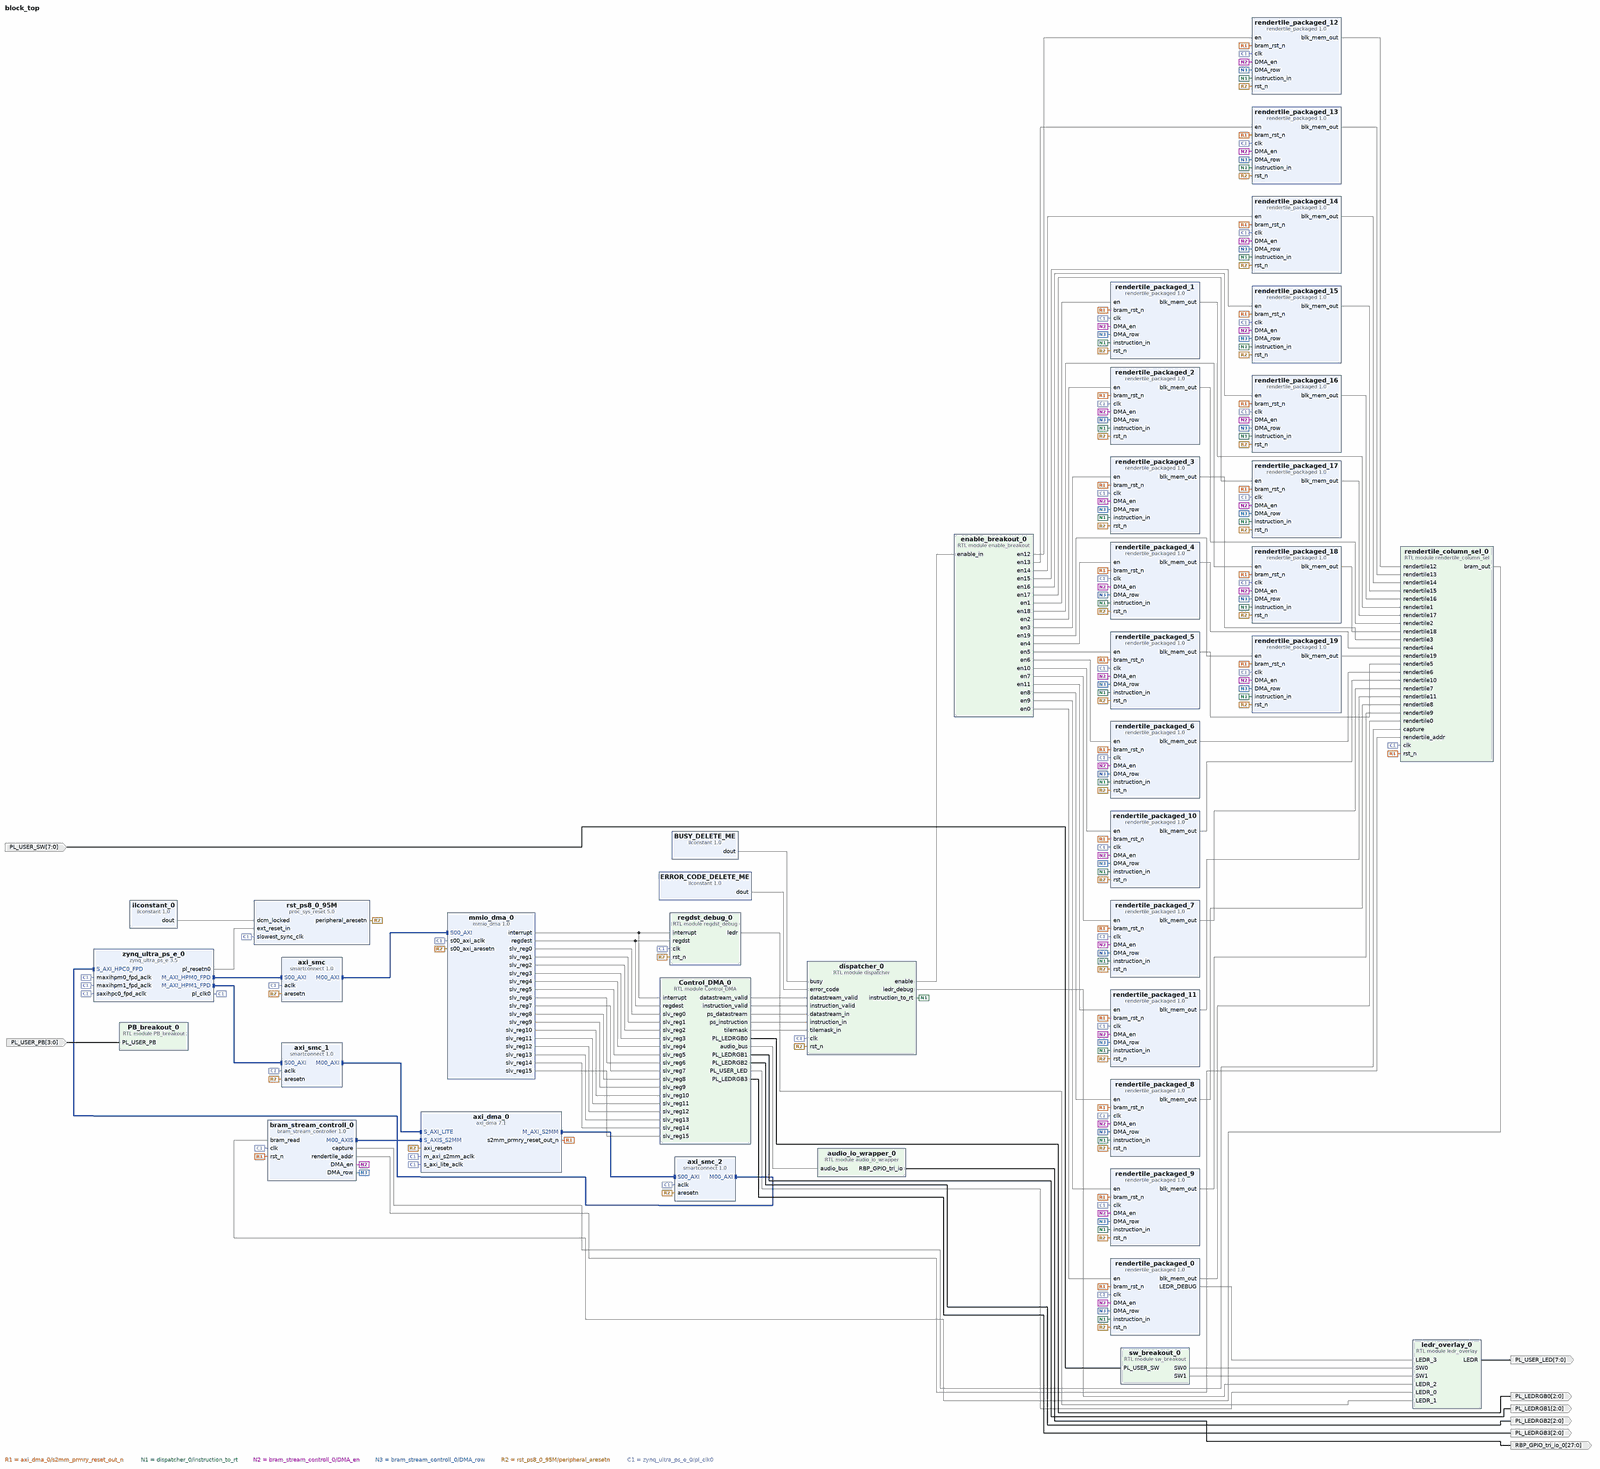
[diagram p0: block diagram of the top level, whole]
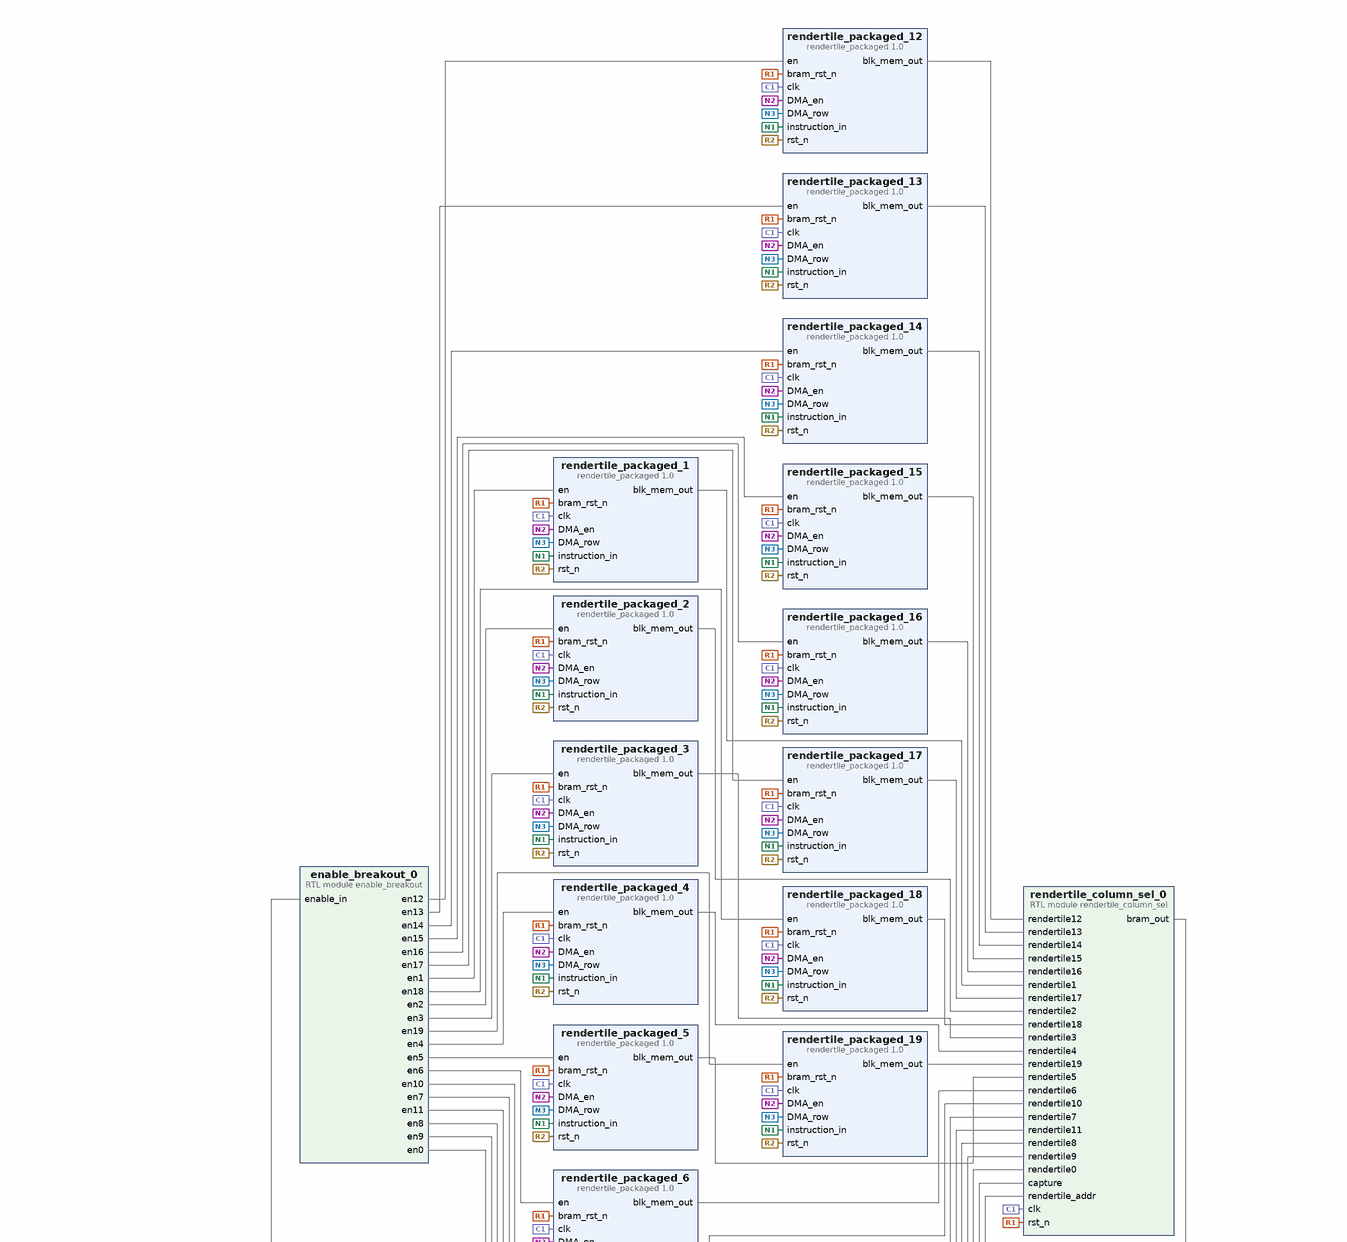
[diagram p1: block diagram of the top level, upper right part]
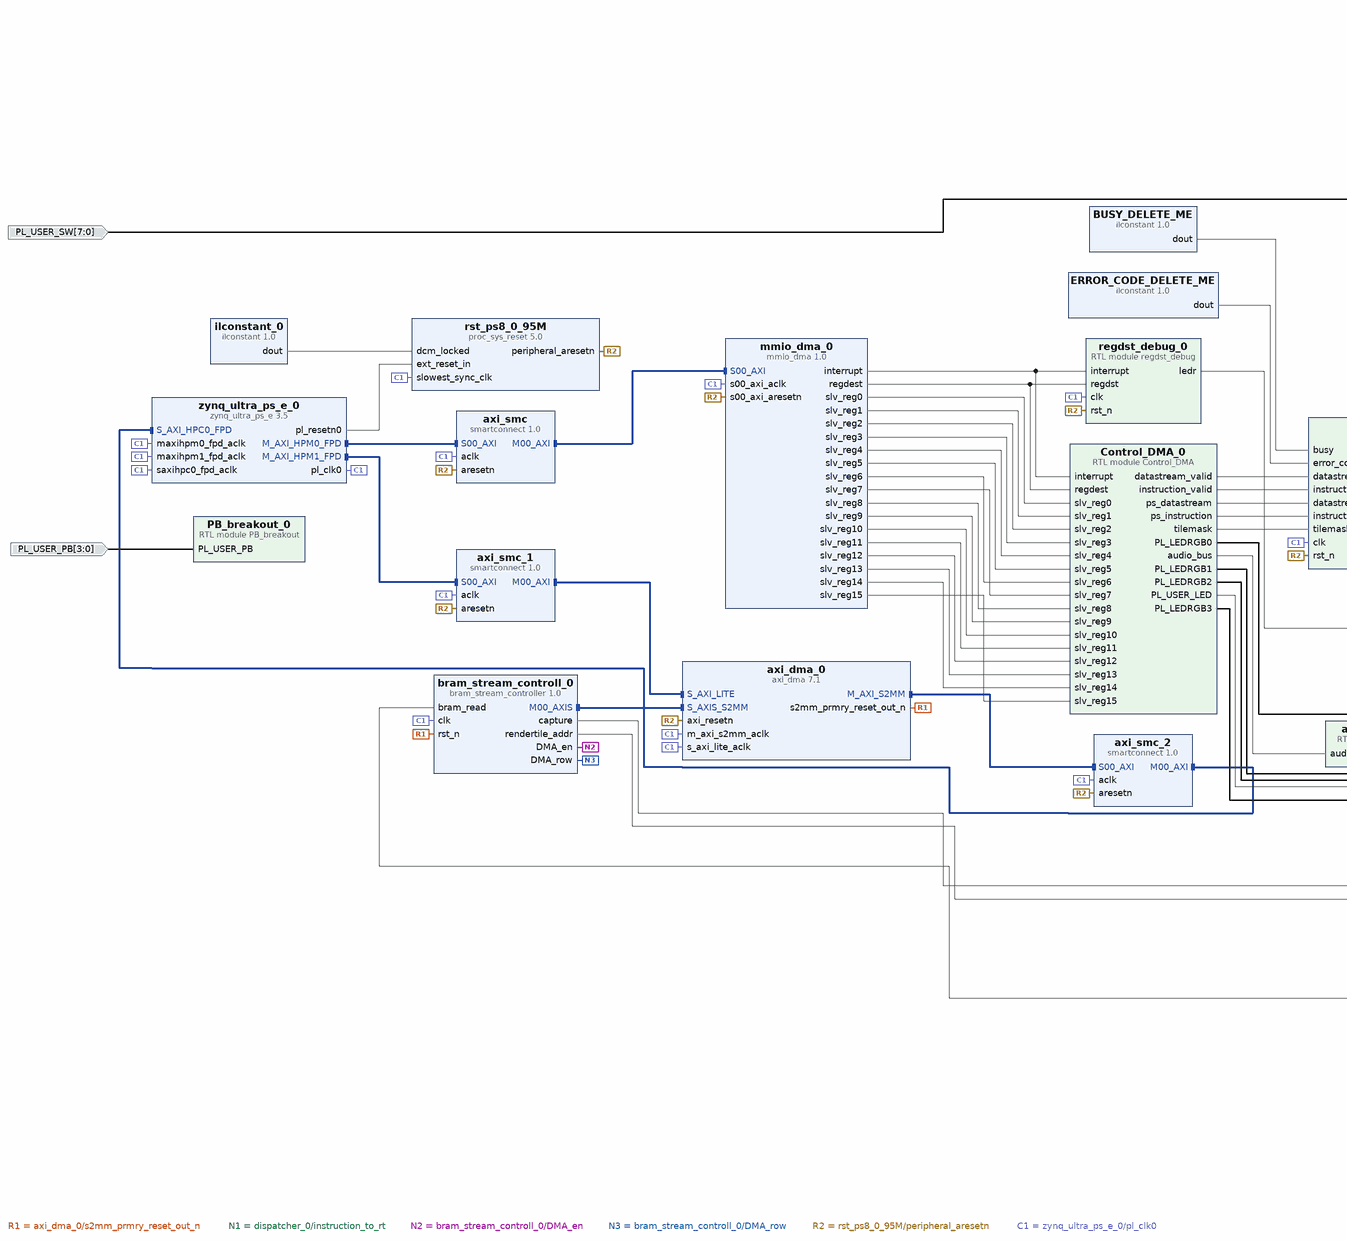
[diagram p2: block diagram of the top level, lower left part]
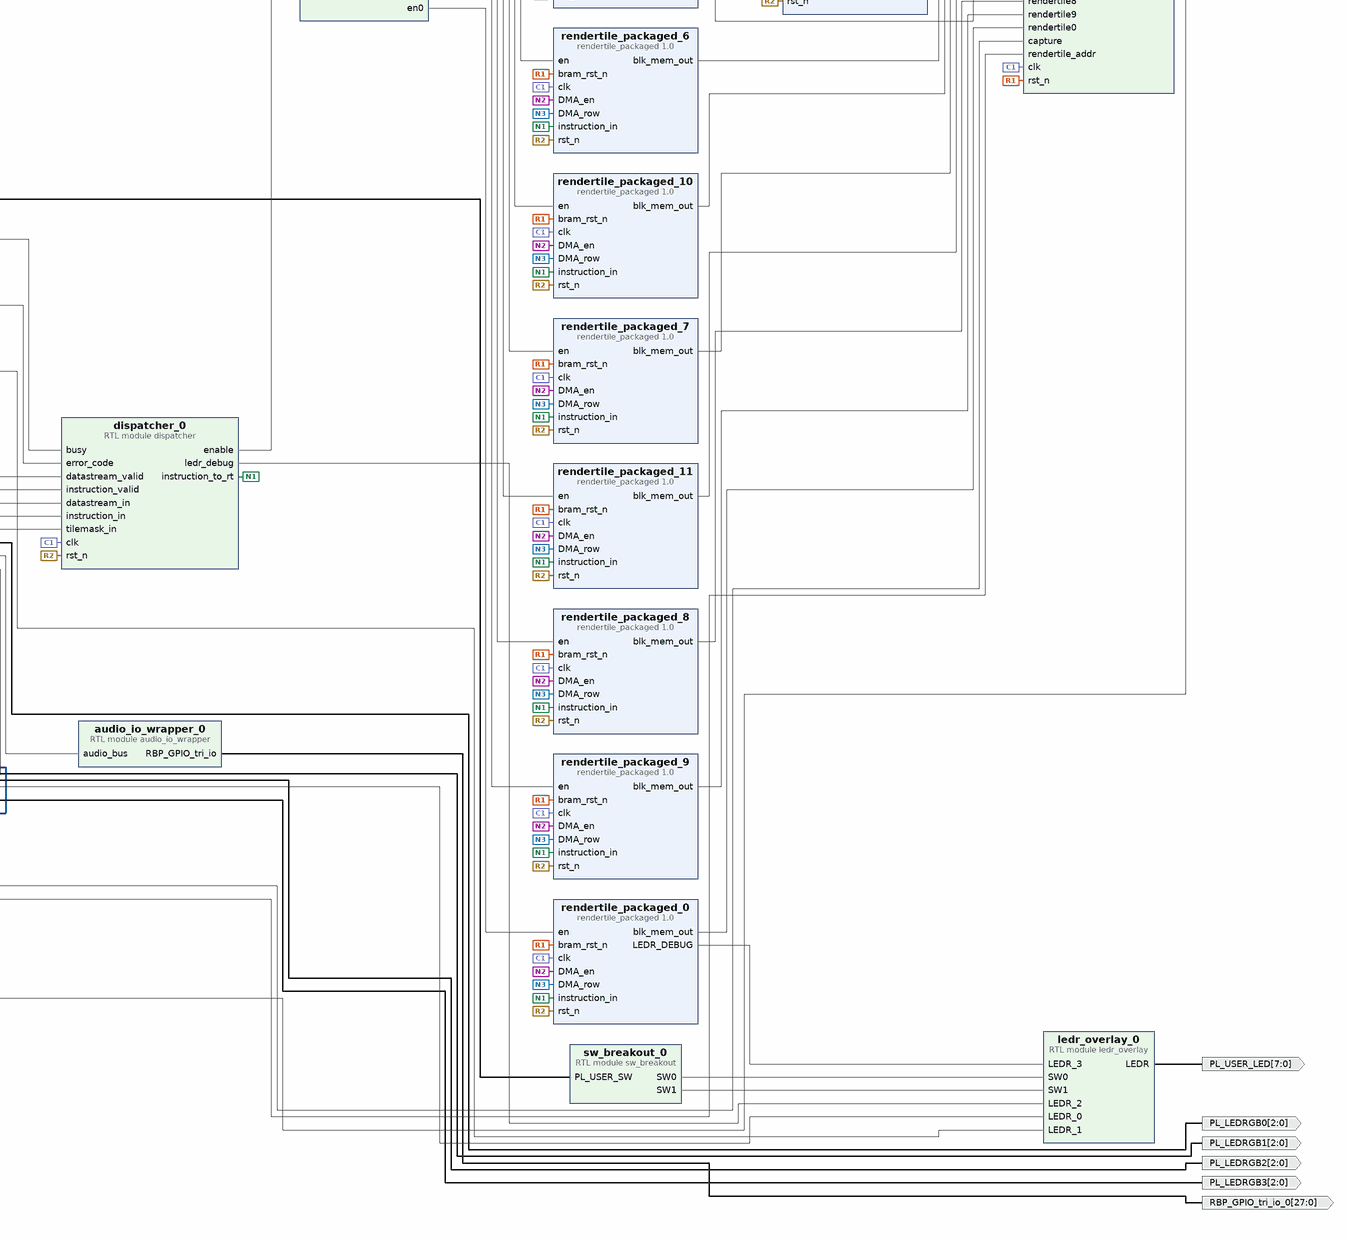
[diagram p3: block diagram of the top level, lower right part]
# Vivado block design block_top, xczu3eg-sfvc784-2-e, Vivado 2025.2
create_bd_design block_top

create_bd_port -dir O -from 7 -to 0 PL_USER_LED
create_bd_port -dir O -from 2 -to 0 PL_LEDRGB0
create_bd_port -dir O -from 2 -to 0 PL_LEDRGB1
create_bd_port -dir O -from 2 -to 0 PL_LEDRGB2
create_bd_port -dir O -from 2 -to 0 PL_LEDRGB3
create_bd_port -dir I -from 3 -to 0 PL_USER_PB
create_bd_port -dir I -from 7 -to 0 PL_USER_SW
create_bd_port -dir O -from 27 -to 0 RBP_GPIO_tri_io_0

create_bd_cell -type ip -vlnv xilinx.com:ip:zynq_ultra_ps_e:3.5 zynq_ultra_ps_e_0
set_property -dict [list \
  CONFIG.CAN0_BOARD_INTERFACE custom \
  CONFIG.CAN1_BOARD_INTERFACE custom \
  CONFIG.CSU_BOARD_INTERFACE custom \
  CONFIG.DP_BOARD_INTERFACE custom \
  CONFIG.GEM0_BOARD_INTERFACE custom \
  CONFIG.GEM1_BOARD_INTERFACE custom \
  CONFIG.GEM2_BOARD_INTERFACE custom \
  CONFIG.GEM3_BOARD_INTERFACE custom \
  CONFIG.GPIO_BOARD_INTERFACE custom \
  CONFIG.IIC0_BOARD_INTERFACE custom \
  CONFIG.IIC1_BOARD_INTERFACE custom \
  CONFIG.NAND_BOARD_INTERFACE custom \
  CONFIG.PCIE_BOARD_INTERFACE custom \
  CONFIG.PJTAG_BOARD_INTERFACE custom \
  CONFIG.PMU_BOARD_INTERFACE custom \
  CONFIG.PSU_BANK_0_IO_STANDARD LVCMOS33 \
  CONFIG.PSU_BANK_1_IO_STANDARD LVCMOS33 \
  CONFIG.PSU_BANK_2_IO_STANDARD LVCMOS33 \
  CONFIG.PSU_BANK_3_IO_STANDARD LVCMOS18 \
  CONFIG.PSU_USB3__DUAL_CLOCK_ENABLE 1 \
  CONFIG.PSU__CAN1__PERIPHERAL__ENABLE 0 \
  CONFIG.PSU__CRF_APB__ACPU_CTRL__FREQMHZ 1200 \
  CONFIG.PSU__CRF_APB__ACPU_CTRL__SRCSEL APLL \
  CONFIG.PSU__CRF_APB__APLL_CTRL__SRCSEL PSS_REF_CLK \
  CONFIG.PSU__CRF_APB__DBG_FPD_CTRL__FREQMHZ 250 \
  CONFIG.PSU__CRF_APB__DBG_FPD_CTRL__SRCSEL IOPLL \
  CONFIG.PSU__CRF_APB__DBG_TRACE_CTRL__FREQMHZ 250 \
  CONFIG.PSU__CRF_APB__DBG_TRACE_CTRL__SRCSEL IOPLL \
  CONFIG.PSU__CRF_APB__DBG_TSTMP_CTRL__FREQMHZ 250 \
  CONFIG.PSU__CRF_APB__DBG_TSTMP_CTRL__SRCSEL IOPLL \
  CONFIG.PSU__CRF_APB__DDR_CTRL__FREQMHZ 1200 \
  CONFIG.PSU__CRF_APB__DDR_CTRL__SRCSEL DPLL \
  CONFIG.PSU__CRF_APB__DPDMA_REF_CTRL__FREQMHZ 600 \
  CONFIG.PSU__CRF_APB__DPDMA_REF_CTRL__SRCSEL DPLL \
  CONFIG.PSU__CRF_APB__DPLL_CTRL__SRCSEL PSS_REF_CLK \
  CONFIG.PSU__CRF_APB__DP_AUDIO_REF_CTRL__SRCSEL RPLL \
  CONFIG.PSU__CRF_APB__DP_STC_REF_CTRL__SRCSEL RPLL \
  CONFIG.PSU__CRF_APB__DP_VIDEO_REF_CTRL__SRCSEL DPLL \
  CONFIG.PSU__CRF_APB__GDMA_REF_CTRL__FREQMHZ 600 \
  CONFIG.PSU__CRF_APB__GDMA_REF_CTRL__SRCSEL DPLL \
  CONFIG.PSU__CRF_APB__GPU_REF_CTRL__FREQMHZ 600 \
  CONFIG.PSU__CRF_APB__GPU_REF_CTRL__SRCSEL DPLL \
  CONFIG.PSU__CRF_APB__TOPSW_LSBUS_CTRL__FREQMHZ 100 \
  CONFIG.PSU__CRF_APB__TOPSW_LSBUS_CTRL__SRCSEL IOPLL \
  CONFIG.PSU__CRF_APB__TOPSW_MAIN_CTRL__FREQMHZ 533.333 \
  CONFIG.PSU__CRF_APB__TOPSW_MAIN_CTRL__SRCSEL DPLL \
  CONFIG.PSU__CRF_APB__VPLL_CTRL__SRCSEL PSS_REF_CLK \
  CONFIG.PSU__CRL_APB__ADMA_REF_CTRL__FREQMHZ 533.333 \
  CONFIG.PSU__CRL_APB__ADMA_REF_CTRL__SRCSEL RPLL \
  CONFIG.PSU__CRL_APB__CAN1_REF_CTRL__FREQMHZ 100 \
  CONFIG.PSU__CRL_APB__CAN1_REF_CTRL__SRCSEL IOPLL \
  CONFIG.PSU__CRL_APB__CPU_R5_CTRL__FREQMHZ 500 \
  CONFIG.PSU__CRL_APB__CPU_R5_CTRL__SRCSEL IOPLL \
  CONFIG.PSU__CRL_APB__DBG_LPD_CTRL__FREQMHZ 250 \
  CONFIG.PSU__CRL_APB__DBG_LPD_CTRL__SRCSEL IOPLL \
  CONFIG.PSU__CRL_APB__GEM3_REF_CTRL__FREQMHZ 125 \
  CONFIG.PSU__CRL_APB__GEM3_REF_CTRL__SRCSEL IOPLL \
  CONFIG.PSU__CRL_APB__I2C0_REF_CTRL__FREQMHZ 100 \
  CONFIG.PSU__CRL_APB__I2C0_REF_CTRL__SRCSEL IOPLL \
  CONFIG.PSU__CRL_APB__I2C1_REF_CTRL__FREQMHZ 100 \
  CONFIG.PSU__CRL_APB__I2C1_REF_CTRL__SRCSEL IOPLL \
  CONFIG.PSU__CRL_APB__IOPLL_CTRL__SRCSEL PSS_REF_CLK \
  CONFIG.PSU__CRL_APB__IOU_SWITCH_CTRL__FREQMHZ 267 \
  CONFIG.PSU__CRL_APB__IOU_SWITCH_CTRL__SRCSEL RPLL \
  CONFIG.PSU__CRL_APB__LPD_LSBUS_CTRL__FREQMHZ 100 \
  CONFIG.PSU__CRL_APB__LPD_LSBUS_CTRL__SRCSEL IOPLL \
  CONFIG.PSU__CRL_APB__LPD_SWITCH_CTRL__FREQMHZ 533.333 \
  CONFIG.PSU__CRL_APB__LPD_SWITCH_CTRL__SRCSEL RPLL \
  CONFIG.PSU__CRL_APB__PCAP_CTRL__FREQMHZ 200 \
  CONFIG.PSU__CRL_APB__PCAP_CTRL__SRCSEL IOPLL \
  CONFIG.PSU__CRL_APB__PL0_REF_CTRL__FREQMHZ 333 \
  CONFIG.PSU__CRL_APB__PL0_REF_CTRL__SRCSEL RPLL \
  CONFIG.PSU__CRL_APB__QSPI_REF_CTRL__FREQMHZ 300 \
  CONFIG.PSU__CRL_APB__QSPI_REF_CTRL__SRCSEL IOPLL \
  CONFIG.PSU__CRL_APB__RPLL_CTRL__SRCSEL PSS_REF_CLK \
  CONFIG.PSU__CRL_APB__SDIO0_REF_CTRL__SRCSEL IOPLL \
  CONFIG.PSU__CRL_APB__SDIO1_REF_CTRL__FREQMHZ 200 \
  CONFIG.PSU__CRL_APB__SDIO1_REF_CTRL__SRCSEL RPLL \
  CONFIG.PSU__CRL_APB__TIMESTAMP_REF_CTRL__FREQMHZ 100 \
  CONFIG.PSU__CRL_APB__TIMESTAMP_REF_CTRL__SRCSEL PSS_REF_CLK \
  CONFIG.PSU__CRL_APB__UART0_REF_CTRL__FREQMHZ 100 \
  CONFIG.PSU__CRL_APB__UART0_REF_CTRL__SRCSEL IOPLL \
  CONFIG.PSU__CRL_APB__UART1_REF_CTRL__FREQMHZ 100 \
  CONFIG.PSU__CRL_APB__UART1_REF_CTRL__SRCSEL IOPLL \
  CONFIG.PSU__CRL_APB__USB0_BUS_REF_CTRL__FREQMHZ 250 \
  CONFIG.PSU__CRL_APB__USB0_BUS_REF_CTRL__SRCSEL IOPLL \
  CONFIG.PSU__CRL_APB__USB3_DUAL_REF_CTRL__FREQMHZ 20 \
  CONFIG.PSU__CRL_APB__USB3_DUAL_REF_CTRL__SRCSEL IOPLL \
  CONFIG.PSU__CRL_APB__USB3__ENABLE 1 \
  CONFIG.PSU__CSUPMU__PERIPHERAL__VALID 0 \
  CONFIG.PSU__DDRC__BUS_WIDTH {32 Bit} \
  CONFIG.PSU__DDRC__COMPONENTS Components \
  CONFIG.PSU__DDRC__DEVICE_CAPACITY {16384 MBits} \
  CONFIG.PSU__DDRC__DRAM_WIDTH {8 Bits} \
  CONFIG.PSU__DDRC__ECC Disabled \
  CONFIG.PSU__DDRC__MEMORY_TYPE {DDR 4} \
  CONFIG.PSU__DDRC__SPEED_BIN DDR4_2400T \
  CONFIG.PSU__DDR_HIGH_ADDRESS_GUI_ENABLE 1 \
  CONFIG.PSU__DDR__INTERFACE__FREQMHZ 600.000 \
  CONFIG.PSU__DEVICE_TYPE EG \
  CONFIG.PSU__DISPLAYPORT__LANE0__ENABLE 1 \
  CONFIG.PSU__DISPLAYPORT__LANE0__IO {GT Lane1} \
  CONFIG.PSU__DISPLAYPORT__LANE1__ENABLE 1 \
  CONFIG.PSU__DISPLAYPORT__LANE1__IO {GT Lane0} \
  CONFIG.PSU__DISPLAYPORT__PERIPHERAL__ENABLE 1 \
  CONFIG.PSU__DLL__ISUSED 1 \
  CONFIG.PSU__DPAUX__PERIPHERAL__ENABLE 1 \
  CONFIG.PSU__DPAUX__PERIPHERAL__IO {MIO 27 .. 30} \
  CONFIG.PSU__DP__LANE_SEL {Dual Lower} \
  CONFIG.PSU__DP__REF_CLK_FREQ 27 \
  CONFIG.PSU__DP__REF_CLK_SEL {Ref Clk0} \
  CONFIG.PSU__ENET3__PERIPHERAL__ENABLE 0 \
  CONFIG.PSU__FPD_SLCR__WDT1__FREQMHZ 100 \
  CONFIG.PSU__FPGA_PL0_ENABLE 1 \
  CONFIG.PSU__GPIO0_MIO__IO {MIO 0 .. 25} \
  CONFIG.PSU__GPIO0_MIO__PERIPHERAL__ENABLE 1 \
  CONFIG.PSU__GPIO1_MIO__IO {MIO 26 .. 51} \
  CONFIG.PSU__GPIO1_MIO__PERIPHERAL__ENABLE 1 \
  CONFIG.PSU__GPIO2_MIO__IO {MIO 52 .. 77} \
  CONFIG.PSU__GPIO2_MIO__PERIPHERAL__ENABLE 1 \
  CONFIG.PSU__GPIO_EMIO_WIDTH 64 \
  CONFIG.PSU__GT__LINK_SPEED HBR \
  CONFIG.PSU__GT__PRE_EMPH_LVL_4 0 \
  CONFIG.PSU__GT__VLT_SWNG_LVL_4 0 \
  CONFIG.PSU__I2C0__PERIPHERAL__ENABLE 1 \
  CONFIG.PSU__I2C0__PERIPHERAL__IO {MIO 34 .. 35} \
  CONFIG.PSU__I2C1__PERIPHERAL__ENABLE 1 \
  CONFIG.PSU__I2C1__PERIPHERAL__IO {MIO 36 .. 37} \
  CONFIG.PSU__IOU_SLCR__IOU_TTC_APB_CLK__TTC0_SEL APB \
  CONFIG.PSU__IOU_SLCR__IOU_TTC_APB_CLK__TTC1_SEL APB \
  CONFIG.PSU__IOU_SLCR__IOU_TTC_APB_CLK__TTC2_SEL APB \
  CONFIG.PSU__IOU_SLCR__IOU_TTC_APB_CLK__TTC3_SEL APB \
  CONFIG.PSU__IOU_SLCR__TTC0__FREQMHZ 100 \
  CONFIG.PSU__IOU_SLCR__TTC1__FREQMHZ 100 \
  CONFIG.PSU__IOU_SLCR__TTC2__FREQMHZ 100 \
  CONFIG.PSU__IOU_SLCR__TTC3__FREQMHZ 100 \
  CONFIG.PSU__IOU_SLCR__WDT0__FREQMHZ 100 \
  CONFIG.PSU__LPD_SLCR__CSUPMU__FREQMHZ 100 \
  CONFIG.PSU__MAXIGP0__DATA_WIDTH 32 \
  CONFIG.PSU__OVERRIDE_HPX_QOS 0 \
  CONFIG.PSU__OVERRIDE__BASIC_CLOCK 0 \
  CONFIG.PSU__PMU__PERIPHERAL__ENABLE 0 \
  CONFIG.PSU__PRESET_APPLIED 0 \
  CONFIG.PSU__PSS_REF_CLK__FREQMHZ 33.33333 \
  CONFIG.PSU__QSPI__PERIPHERAL__ENABLE 0 \
  CONFIG.PSU__SATA__PERIPHERAL__ENABLE 0 \
  CONFIG.PSU__SD0__CLK_50_SDR_ITAP_DLY 0x15 \
  CONFIG.PSU__SD0__CLK_50_SDR_OTAP_DLY 0x5 \
  CONFIG.PSU__SD0__DATA_TRANSFER_MODE 4Bit \
  CONFIG.PSU__SD0__GRP_CD__ENABLE 1 \
  CONFIG.PSU__SD0__GRP_CD__IO {MIO 24} \
  CONFIG.PSU__SD0__PERIPHERAL__ENABLE 1 \
  CONFIG.PSU__SD0__PERIPHERAL__IO {MIO 13 .. 16 21 22} \
  CONFIG.PSU__SD0__SLOT_TYPE {SD 2.0} \
  CONFIG.PSU__SD1__CLK_100_SDR_OTAP_DLY 0x3 \
  CONFIG.PSU__SD1__CLK_200_SDR_OTAP_DLY 0x3 \
  CONFIG.PSU__SD1__CLK_50_DDR_ITAP_DLY 0x3D \
  CONFIG.PSU__SD1__CLK_50_DDR_OTAP_DLY 0x4 \
  CONFIG.PSU__SD1__CLK_50_SDR_ITAP_DLY 0x15 \
  CONFIG.PSU__SD1__CLK_50_SDR_OTAP_DLY 0x5 \
  CONFIG.PSU__SD1__PERIPHERAL__ENABLE 0 \
  CONFIG.PSU__SWDT0__PERIPHERAL__ENABLE 0 \
  CONFIG.PSU__SWDT1__PERIPHERAL__ENABLE 0 \
  CONFIG.PSU__TTC0__PERIPHERAL__ENABLE 0 \
  CONFIG.PSU__TTC1__PERIPHERAL__ENABLE 0 \
  CONFIG.PSU__TTC2__PERIPHERAL__ENABLE 0 \
  CONFIG.PSU__TTC3__PERIPHERAL__ENABLE 0 \
  CONFIG.PSU__UART0__PERIPHERAL__ENABLE 0 \
  CONFIG.PSU__UART1__BAUD_RATE 115200 \
  CONFIG.PSU__UART1__MODEM__ENABLE 0 \
  CONFIG.PSU__UART1__PERIPHERAL__ENABLE 1 \
  CONFIG.PSU__UART1__PERIPHERAL__IO {MIO 32 .. 33} \
  CONFIG.PSU__USB0_COHERENCY 0 \
  CONFIG.PSU__USB0__PERIPHERAL__ENABLE 1 \
  CONFIG.PSU__USB0__PERIPHERAL__IO {MIO 52 .. 63} \
  CONFIG.PSU__USB0__REF_CLK_FREQ 100 \
  CONFIG.PSU__USB0__REF_CLK_SEL {Ref Clk1} \
  CONFIG.PSU__USB0__RESET__ENABLE 1 \
  CONFIG.PSU__USB0__RESET__IO {MIO 76} \
  CONFIG.PSU__USB1__PERIPHERAL__ENABLE 1 \
  CONFIG.PSU__USB1__PERIPHERAL__IO {MIO 64 .. 75} \
  CONFIG.PSU__USB1__REF_CLK_FREQ 100 \
  CONFIG.PSU__USB1__REF_CLK_SEL {Ref Clk1} \
  CONFIG.PSU__USB2_0__EMIO__ENABLE 0 \
  CONFIG.PSU__USB3_0__EMIO__ENABLE 0 \
  CONFIG.PSU__USB3_0__PERIPHERAL__ENABLE 1 \
  CONFIG.PSU__USB3_0__PERIPHERAL__IO {GT Lane2} \
  CONFIG.PSU__USB3_1__PERIPHERAL__ENABLE 1 \
  CONFIG.PSU__USB3_1__PERIPHERAL__IO {GT Lane3} \
  CONFIG.PSU__USB__RESET__MODE {Shared MIO Pin} \
  CONFIG.PSU__USB__RESET__POLARITY {Active Low} \
  CONFIG.PSU__USE__IRQ0 0 \
  CONFIG.PSU__USE__M_AXI_GP0 1 \
  CONFIG.PSU__USE__M_AXI_GP1 1 \
  CONFIG.PSU__USE__M_AXI_GP2 0 \
  CONFIG.PSU__USE__S_AXI_GP0 1 \
  CONFIG.QSPI_BOARD_INTERFACE custom \
  CONFIG.SATA_BOARD_INTERFACE custom \
  CONFIG.SD0_BOARD_INTERFACE custom \
  CONFIG.SD1_BOARD_INTERFACE custom \
  CONFIG.SPI0_BOARD_INTERFACE custom \
  CONFIG.SPI1_BOARD_INTERFACE custom \
  CONFIG.SUBPRESET1 Custom \
  CONFIG.SUBPRESET2 Custom \
  CONFIG.SWDT0_BOARD_INTERFACE custom \
  CONFIG.SWDT1_BOARD_INTERFACE custom \
  CONFIG.TRACE_BOARD_INTERFACE custom \
  CONFIG.TTC0_BOARD_INTERFACE custom \
  CONFIG.TTC1_BOARD_INTERFACE custom \
  CONFIG.TTC2_BOARD_INTERFACE custom \
  CONFIG.TTC3_BOARD_INTERFACE custom \
  CONFIG.UART0_BOARD_INTERFACE custom \
  CONFIG.UART1_BOARD_INTERFACE custom \
  CONFIG.USB0_BOARD_INTERFACE custom \
  CONFIG.USB1_BOARD_INTERFACE custom \
] [get_bd_cells zynq_ultra_ps_e_0]
# 766 more settings of zynq_ultra_ps_e_0 are not shown: defaults, MIO pin electricals, DDR timing, and values the tool derives
create_bd_cell -type ip -vlnv user.org:user:mmio_dma:1.0 mmio_dma_0
create_bd_cell -type ip -vlnv xilinx.com:ip:smartconnect:1.0 axi_smc
set_property -dict {CONFIG.NUM_SI 1} [get_bd_cells axi_smc]
create_bd_cell -type ip -vlnv xilinx.com:ip:proc_sys_reset:5.0 rst_ps8_0_95M
create_bd_cell -type module -reference Control_DMA Control_DMA_0
create_bd_cell -type module -reference PB_breakout PB_breakout_0
create_bd_cell -type module -reference dispatcher dispatcher_0
create_bd_cell -type module -reference sw_breakout sw_breakout_0
create_bd_cell -type module -reference ledr_overlay ledr_overlay_0
create_bd_cell -type inline_hdl -vlnv xilinx.com:inline_hdl:ilconstant:1.0 ilconstant_0
create_bd_cell -type module -reference regdst_debug regdst_debug_0
create_bd_cell -type ip -vlnv xilinx.com:ip:axi_dma:7.1 axi_dma_0
set_property -dict [list \
  CONFIG.c_include_mm2s 0 \
  CONFIG.c_include_sg 0 \
  CONFIG.c_m_axi_s2mm_data_width 256 \
  CONFIG.c_s2mm_burst_size 2 \
  CONFIG.c_s_axis_s2mm_tdata_width 256 \
  CONFIG.c_sg_length_width 26 \
] [get_bd_cells axi_dma_0]
create_bd_cell -type ip -vlnv xilinx.com:ip:smartconnect:1.0 axi_smc_1
set_property -dict {CONFIG.NUM_SI 1} [get_bd_cells axi_smc_1]
create_bd_cell -type ip -vlnv xilinx.com:ip:smartconnect:1.0 axi_smc_2
set_property -dict {CONFIG.NUM_SI 1} [get_bd_cells axi_smc_2]
create_bd_cell -type module -reference enable_breakout enable_breakout_0
create_bd_cell -type ip -vlnv user.org:user:rendertile_packaged:1.0 rendertile_packaged_0
create_bd_cell -type ip -vlnv user.org:user:rendertile_packaged:1.0 rendertile_packaged_1
create_bd_cell -type ip -vlnv user.org:user:rendertile_packaged:1.0 rendertile_packaged_2
create_bd_cell -type ip -vlnv user.org:user:rendertile_packaged:1.0 rendertile_packaged_3
create_bd_cell -type ip -vlnv user.org:user:rendertile_packaged:1.0 rendertile_packaged_4
create_bd_cell -type ip -vlnv user.org:user:rendertile_packaged:1.0 rendertile_packaged_5
create_bd_cell -type ip -vlnv user.org:user:rendertile_packaged:1.0 rendertile_packaged_6
create_bd_cell -type ip -vlnv user.org:user:rendertile_packaged:1.0 rendertile_packaged_7
create_bd_cell -type ip -vlnv user.org:user:rendertile_packaged:1.0 rendertile_packaged_8
create_bd_cell -type ip -vlnv user.org:user:rendertile_packaged:1.0 rendertile_packaged_9
create_bd_cell -type ip -vlnv user.org:user:rendertile_packaged:1.0 rendertile_packaged_10
create_bd_cell -type ip -vlnv user.org:user:rendertile_packaged:1.0 rendertile_packaged_11
create_bd_cell -type ip -vlnv user.org:user:rendertile_packaged:1.0 rendertile_packaged_12
create_bd_cell -type ip -vlnv user.org:user:rendertile_packaged:1.0 rendertile_packaged_13
create_bd_cell -type ip -vlnv user.org:user:rendertile_packaged:1.0 rendertile_packaged_14
create_bd_cell -type ip -vlnv user.org:user:rendertile_packaged:1.0 rendertile_packaged_15
create_bd_cell -type ip -vlnv user.org:user:rendertile_packaged:1.0 rendertile_packaged_16
create_bd_cell -type ip -vlnv user.org:user:rendertile_packaged:1.0 rendertile_packaged_17
create_bd_cell -type ip -vlnv user.org:user:rendertile_packaged:1.0 rendertile_packaged_18
create_bd_cell -type ip -vlnv user.org:user:rendertile_packaged:1.0 rendertile_packaged_19
create_bd_cell -type inline_hdl -vlnv xilinx.com:inline_hdl:ilconstant:1.0 ERROR_CODE_DELETE_ME
set_property -dict {CONFIG.CONST_VAL 0 CONFIG.CONST_WIDTH 4} [get_bd_cells ERROR_CODE_DELETE_ME]
create_bd_cell -type inline_hdl -vlnv xilinx.com:inline_hdl:ilconstant:1.0 BUSY_DELETE_ME
set_property -dict {CONFIG.CONST_VAL 0 CONFIG.CONST_WIDTH 32} [get_bd_cells BUSY_DELETE_ME]
create_bd_cell -type module -reference rendertile_column_sel rendertile_column_sel_0
create_bd_cell -type ip -vlnv user.org:user:bram_stream_controller:1.0 bram_stream_controll_0
set_property -dict {CONFIG.NUM_PIXEL 64 CONFIG.READ_DELAY 3} [get_bd_cells bram_stream_controll_0]
create_bd_cell -type module -reference audio_io_wrapper audio_io_wrapper_0

# ---- connections ----

connect_bd_intf_net [get_bd_intf_pins axi_dma_0/M_AXI_S2MM] [get_bd_intf_pins axi_smc_2/S00_AXI]
connect_bd_intf_net [get_bd_intf_pins axi_smc_1/M00_AXI] [get_bd_intf_pins axi_dma_0/S_AXI_LITE]
connect_bd_intf_net [get_bd_intf_pins axi_smc_2/M00_AXI] [get_bd_intf_pins zynq_ultra_ps_e_0/S_AXI_HPC0_FPD]
connect_bd_intf_net [get_bd_intf_pins axi_smc/M00_AXI] [get_bd_intf_pins mmio_dma_0/S00_AXI]
connect_bd_intf_net [get_bd_intf_pins bram_stream_controll_0/M00_AXIS] [get_bd_intf_pins axi_dma_0/S_AXIS_S2MM]
connect_bd_intf_net [get_bd_intf_pins zynq_ultra_ps_e_0/M_AXI_HPM0_FPD] [get_bd_intf_pins axi_smc/S00_AXI]
connect_bd_intf_net [get_bd_intf_pins zynq_ultra_ps_e_0/M_AXI_HPM1_FPD] [get_bd_intf_pins axi_smc_1/S00_AXI]
connect_bd_net [get_bd_pins BUSY_DELETE_ME/dout] [get_bd_pins dispatcher_0/busy]
connect_bd_net [get_bd_pins Control_DMA_0/PL_LEDRGB0] [get_bd_ports PL_LEDRGB0]
connect_bd_net [get_bd_pins Control_DMA_0/PL_LEDRGB1] [get_bd_ports PL_LEDRGB1]
connect_bd_net [get_bd_pins Control_DMA_0/PL_LEDRGB2] [get_bd_ports PL_LEDRGB2]
connect_bd_net [get_bd_pins Control_DMA_0/PL_LEDRGB3] [get_bd_ports PL_LEDRGB3]
connect_bd_net [get_bd_pins Control_DMA_0/PL_USER_LED] [get_bd_pins ledr_overlay_0/LEDR_0]
connect_bd_net [get_bd_pins Control_DMA_0/audio_bus] [get_bd_pins audio_io_wrapper_0/audio_bus]
connect_bd_net [get_bd_pins Control_DMA_0/datastream_valid] [get_bd_pins dispatcher_0/datastream_valid]
connect_bd_net [get_bd_pins Control_DMA_0/instruction_valid] [get_bd_pins dispatcher_0/instruction_valid]
connect_bd_net [get_bd_pins Control_DMA_0/ps_datastream] [get_bd_pins dispatcher_0/datastream_in]
connect_bd_net [get_bd_pins Control_DMA_0/ps_instruction] [get_bd_pins dispatcher_0/instruction_in]
connect_bd_net [get_bd_pins Control_DMA_0/tilemask] [get_bd_pins dispatcher_0/tilemask_in]
connect_bd_net [get_bd_pins ERROR_CODE_DELETE_ME/dout] [get_bd_pins dispatcher_0/error_code]
connect_bd_net [get_bd_ports PL_USER_PB] [get_bd_pins PB_breakout_0/PL_USER_PB]
connect_bd_net -net PL_USER_SW_0_1 [get_bd_ports PL_USER_SW] [get_bd_pins sw_breakout_0/PL_USER_SW]
connect_bd_net [get_bd_pins audio_io_wrapper_0/RBP_GPIO_tri_io] [get_bd_ports RBP_GPIO_tri_io_0]
connect_bd_net [get_bd_pins axi_dma_0/s2mm_prmry_reset_out_n] \
  [get_bd_pins rendertile_column_sel_0/rst_n] [get_bd_pins rendertile_packaged_0/bram_rst_n] \
  [get_bd_pins rendertile_packaged_1/bram_rst_n] [get_bd_pins rendertile_packaged_11/bram_rst_n] \
  [get_bd_pins rendertile_packaged_12/bram_rst_n] [get_bd_pins rendertile_packaged_13/bram_rst_n] \
  [get_bd_pins rendertile_packaged_14/bram_rst_n] [get_bd_pins rendertile_packaged_15/bram_rst_n] \
  [get_bd_pins rendertile_packaged_16/bram_rst_n] [get_bd_pins rendertile_packaged_17/bram_rst_n] \
  [get_bd_pins rendertile_packaged_18/bram_rst_n] [get_bd_pins rendertile_packaged_19/bram_rst_n] \
  [get_bd_pins rendertile_packaged_2/bram_rst_n] [get_bd_pins rendertile_packaged_3/bram_rst_n] \
  [get_bd_pins rendertile_packaged_4/bram_rst_n] [get_bd_pins rendertile_packaged_5/bram_rst_n] \
  [get_bd_pins rendertile_packaged_6/bram_rst_n] [get_bd_pins rendertile_packaged_7/bram_rst_n] \
  [get_bd_pins rendertile_packaged_8/bram_rst_n] [get_bd_pins rendertile_packaged_9/bram_rst_n] \
  [get_bd_pins rendertile_packaged_10/bram_rst_n] [get_bd_pins bram_stream_controll_0/rst_n]
connect_bd_net [get_bd_pins bram_stream_controll_0/capture] [get_bd_pins rendertile_column_sel_0/capture]
connect_bd_net [get_bd_pins bram_stream_controll_0/rendertile_addr] [get_bd_pins rendertile_column_sel_0/rendertile_addr]
connect_bd_net [get_bd_pins dispatcher_0/enable] [get_bd_pins enable_breakout_0/enable_in]
connect_bd_net [get_bd_pins dispatcher_0/instruction_to_rt] \
  [get_bd_pins rendertile_packaged_0/instruction_in] [get_bd_pins rendertile_packaged_1/instruction_in] \
  [get_bd_pins rendertile_packaged_11/instruction_in] [get_bd_pins rendertile_packaged_12/instruction_in] \
  [get_bd_pins rendertile_packaged_13/instruction_in] [get_bd_pins rendertile_packaged_14/instruction_in] \
  [get_bd_pins rendertile_packaged_15/instruction_in] [get_bd_pins rendertile_packaged_16/instruction_in] \
  [get_bd_pins rendertile_packaged_17/instruction_in] [get_bd_pins rendertile_packaged_18/instruction_in] \
  [get_bd_pins rendertile_packaged_19/instruction_in] [get_bd_pins rendertile_packaged_2/instruction_in] \
  [get_bd_pins rendertile_packaged_3/instruction_in] [get_bd_pins rendertile_packaged_4/instruction_in] \
  [get_bd_pins rendertile_packaged_5/instruction_in] [get_bd_pins rendertile_packaged_6/instruction_in] \
  [get_bd_pins rendertile_packaged_7/instruction_in] [get_bd_pins rendertile_packaged_8/instruction_in] \
  [get_bd_pins rendertile_packaged_9/instruction_in] [get_bd_pins rendertile_packaged_10/instruction_in]
connect_bd_net [get_bd_pins dispatcher_0/ledr_debug] [get_bd_pins ledr_overlay_0/LEDR_2]
connect_bd_net [get_bd_pins enable_breakout_0/en0] [get_bd_pins rendertile_packaged_0/en]
connect_bd_net [get_bd_pins enable_breakout_0/en1] [get_bd_pins rendertile_packaged_1/en]
connect_bd_net [get_bd_pins enable_breakout_0/en2] [get_bd_pins rendertile_packaged_2/en]
connect_bd_net [get_bd_pins enable_breakout_0/en3] [get_bd_pins rendertile_packaged_3/en]
connect_bd_net [get_bd_pins enable_breakout_0/en4] [get_bd_pins rendertile_packaged_4/en]
connect_bd_net [get_bd_pins enable_breakout_0/en5] [get_bd_pins rendertile_packaged_5/en]
connect_bd_net [get_bd_pins enable_breakout_0/en6] [get_bd_pins rendertile_packaged_6/en]
connect_bd_net [get_bd_pins enable_breakout_0/en7] [get_bd_pins rendertile_packaged_7/en]
connect_bd_net [get_bd_pins enable_breakout_0/en8] [get_bd_pins rendertile_packaged_8/en]
connect_bd_net [get_bd_pins enable_breakout_0/en9] [get_bd_pins rendertile_packaged_9/en]
connect_bd_net [get_bd_pins enable_breakout_0/en10] [get_bd_pins rendertile_packaged_10/en]
connect_bd_net [get_bd_pins enable_breakout_0/en11] [get_bd_pins rendertile_packaged_11/en]
connect_bd_net [get_bd_pins enable_breakout_0/en12] [get_bd_pins rendertile_packaged_12/en]
connect_bd_net [get_bd_pins enable_breakout_0/en13] [get_bd_pins rendertile_packaged_13/en]
connect_bd_net [get_bd_pins enable_breakout_0/en14] [get_bd_pins rendertile_packaged_14/en]
connect_bd_net [get_bd_pins enable_breakout_0/en15] [get_bd_pins rendertile_packaged_15/en]
connect_bd_net [get_bd_pins enable_breakout_0/en16] [get_bd_pins rendertile_packaged_16/en]
connect_bd_net [get_bd_pins enable_breakout_0/en17] [get_bd_pins rendertile_packaged_17/en]
connect_bd_net [get_bd_pins enable_breakout_0/en18] [get_bd_pins rendertile_packaged_18/en]
connect_bd_net [get_bd_pins enable_breakout_0/en19] [get_bd_pins rendertile_packaged_19/en]
connect_bd_net [get_bd_pins ilconstant_0/dout] [get_bd_pins rst_ps8_0_95M/dcm_locked]
connect_bd_net [get_bd_pins ledr_overlay_0/LEDR] [get_bd_ports PL_USER_LED]
connect_bd_net [get_bd_pins mmio_dma_0/interrupt] [get_bd_pins regdst_debug_0/interrupt] [get_bd_pins Control_DMA_0/interrupt]
connect_bd_net [get_bd_pins mmio_dma_0/regdest] [get_bd_pins regdst_debug_0/regdst] [get_bd_pins Control_DMA_0/regdest]
connect_bd_net [get_bd_pins mmio_dma_0/slv_reg0] [get_bd_pins Control_DMA_0/slv_reg0]
connect_bd_net [get_bd_pins mmio_dma_0/slv_reg1] [get_bd_pins Control_DMA_0/slv_reg1]
connect_bd_net [get_bd_pins mmio_dma_0/slv_reg2] [get_bd_pins Control_DMA_0/slv_reg2]
connect_bd_net [get_bd_pins mmio_dma_0/slv_reg3] [get_bd_pins Control_DMA_0/slv_reg3]
connect_bd_net [get_bd_pins mmio_dma_0/slv_reg4] [get_bd_pins Control_DMA_0/slv_reg4]
connect_bd_net [get_bd_pins mmio_dma_0/slv_reg5] [get_bd_pins Control_DMA_0/slv_reg5]
connect_bd_net [get_bd_pins mmio_dma_0/slv_reg6] [get_bd_pins Control_DMA_0/slv_reg6]
connect_bd_net [get_bd_pins mmio_dma_0/slv_reg7] [get_bd_pins Control_DMA_0/slv_reg7]
connect_bd_net [get_bd_pins mmio_dma_0/slv_reg8] [get_bd_pins Control_DMA_0/slv_reg8]
connect_bd_net [get_bd_pins mmio_dma_0/slv_reg9] [get_bd_pins Control_DMA_0/slv_reg9]
connect_bd_net [get_bd_pins mmio_dma_0/slv_reg10] [get_bd_pins Control_DMA_0/slv_reg10]
connect_bd_net [get_bd_pins mmio_dma_0/slv_reg11] [get_bd_pins Control_DMA_0/slv_reg11]
connect_bd_net [get_bd_pins mmio_dma_0/slv_reg12] [get_bd_pins Control_DMA_0/slv_reg12]
connect_bd_net [get_bd_pins mmio_dma_0/slv_reg13] [get_bd_pins Control_DMA_0/slv_reg13]
connect_bd_net [get_bd_pins mmio_dma_0/slv_reg14] [get_bd_pins Control_DMA_0/slv_reg14]
connect_bd_net [get_bd_pins mmio_dma_0/slv_reg15] [get_bd_pins Control_DMA_0/slv_reg15]
connect_bd_net -net pixel_cntr_0_DMA_en [get_bd_pins bram_stream_controll_0/DMA_en] \
  [get_bd_pins rendertile_packaged_0/DMA_en] [get_bd_pins rendertile_packaged_1/DMA_en] \
  [get_bd_pins rendertile_packaged_11/DMA_en] [get_bd_pins rendertile_packaged_12/DMA_en] \
  [get_bd_pins rendertile_packaged_13/DMA_en] [get_bd_pins rendertile_packaged_14/DMA_en] \
  [get_bd_pins rendertile_packaged_15/DMA_en] [get_bd_pins rendertile_packaged_16/DMA_en] \
  [get_bd_pins rendertile_packaged_17/DMA_en] [get_bd_pins rendertile_packaged_18/DMA_en] \
  [get_bd_pins rendertile_packaged_19/DMA_en] [get_bd_pins rendertile_packaged_2/DMA_en] \
  [get_bd_pins rendertile_packaged_3/DMA_en] [get_bd_pins rendertile_packaged_4/DMA_en] \
  [get_bd_pins rendertile_packaged_5/DMA_en] [get_bd_pins rendertile_packaged_6/DMA_en] \
  [get_bd_pins rendertile_packaged_7/DMA_en] [get_bd_pins rendertile_packaged_8/DMA_en] \
  [get_bd_pins rendertile_packaged_9/DMA_en] [get_bd_pins rendertile_packaged_10/DMA_en]
connect_bd_net -net pixel_cntr_0_DMA_row [get_bd_pins bram_stream_controll_0/DMA_row] \
  [get_bd_pins rendertile_packaged_0/DMA_row] [get_bd_pins rendertile_packaged_1/DMA_row] \
  [get_bd_pins rendertile_packaged_11/DMA_row] [get_bd_pins rendertile_packaged_12/DMA_row] \
  [get_bd_pins rendertile_packaged_13/DMA_row] [get_bd_pins rendertile_packaged_14/DMA_row] \
  [get_bd_pins rendertile_packaged_15/DMA_row] [get_bd_pins rendertile_packaged_16/DMA_row] \
  [get_bd_pins rendertile_packaged_17/DMA_row] [get_bd_pins rendertile_packaged_18/DMA_row] \
  [get_bd_pins rendertile_packaged_19/DMA_row] [get_bd_pins rendertile_packaged_2/DMA_row] \
  [get_bd_pins rendertile_packaged_3/DMA_row] [get_bd_pins rendertile_packaged_4/DMA_row] \
  [get_bd_pins rendertile_packaged_5/DMA_row] [get_bd_pins rendertile_packaged_6/DMA_row] \
  [get_bd_pins rendertile_packaged_7/DMA_row] [get_bd_pins rendertile_packaged_8/DMA_row] \
  [get_bd_pins rendertile_packaged_9/DMA_row] [get_bd_pins rendertile_packaged_10/DMA_row]
connect_bd_net [get_bd_pins regdst_debug_0/ledr] [get_bd_pins ledr_overlay_0/LEDR_1]
connect_bd_net [get_bd_pins rendertile_column_sel_0/bram_out] [get_bd_pins bram_stream_controll_0/bram_read]
connect_bd_net [get_bd_pins rendertile_packaged_0/LEDR_DEBUG] [get_bd_pins ledr_overlay_0/LEDR_3]
connect_bd_net [get_bd_pins rendertile_packaged_0/blk_mem_out] [get_bd_pins rendertile_column_sel_0/rendertile0]
connect_bd_net [get_bd_pins rendertile_packaged_10/blk_mem_out] [get_bd_pins rendertile_column_sel_0/rendertile10]
connect_bd_net [get_bd_pins rendertile_packaged_11/blk_mem_out] [get_bd_pins rendertile_column_sel_0/rendertile11]
connect_bd_net [get_bd_pins rendertile_packaged_12/blk_mem_out] [get_bd_pins rendertile_column_sel_0/rendertile12]
connect_bd_net [get_bd_pins rendertile_packaged_13/blk_mem_out] [get_bd_pins rendertile_column_sel_0/rendertile13]
connect_bd_net [get_bd_pins rendertile_packaged_14/blk_mem_out] [get_bd_pins rendertile_column_sel_0/rendertile14]
connect_bd_net [get_bd_pins rendertile_packaged_15/blk_mem_out] [get_bd_pins rendertile_column_sel_0/rendertile15]
connect_bd_net [get_bd_pins rendertile_packaged_16/blk_mem_out] [get_bd_pins rendertile_column_sel_0/rendertile16]
connect_bd_net [get_bd_pins rendertile_packaged_17/blk_mem_out] [get_bd_pins rendertile_column_sel_0/rendertile17]
connect_bd_net [get_bd_pins rendertile_packaged_18/blk_mem_out] [get_bd_pins rendertile_column_sel_0/rendertile18]
connect_bd_net [get_bd_pins rendertile_packaged_19/blk_mem_out] [get_bd_pins rendertile_column_sel_0/rendertile19]
connect_bd_net [get_bd_pins rendertile_packaged_1/blk_mem_out] [get_bd_pins rendertile_column_sel_0/rendertile1]
connect_bd_net [get_bd_pins rendertile_packaged_2/blk_mem_out] [get_bd_pins rendertile_column_sel_0/rendertile2]
connect_bd_net [get_bd_pins rendertile_packaged_3/blk_mem_out] [get_bd_pins rendertile_column_sel_0/rendertile3]
connect_bd_net [get_bd_pins rendertile_packaged_4/blk_mem_out] [get_bd_pins rendertile_column_sel_0/rendertile4]
connect_bd_net [get_bd_pins rendertile_packaged_5/blk_mem_out] [get_bd_pins rendertile_column_sel_0/rendertile5]
connect_bd_net [get_bd_pins rendertile_packaged_6/blk_mem_out] [get_bd_pins rendertile_column_sel_0/rendertile6]
connect_bd_net [get_bd_pins rendertile_packaged_7/blk_mem_out] [get_bd_pins rendertile_column_sel_0/rendertile7]
connect_bd_net [get_bd_pins rendertile_packaged_8/blk_mem_out] [get_bd_pins rendertile_column_sel_0/rendertile8]
connect_bd_net [get_bd_pins rendertile_packaged_9/blk_mem_out] [get_bd_pins rendertile_column_sel_0/rendertile9]
connect_bd_net [get_bd_pins rst_ps8_0_95M/peripheral_aresetn] \
  [get_bd_pins axi_smc/aresetn] [get_bd_pins mmio_dma_0/s00_axi_aresetn] [get_bd_pins axi_dma_0/axi_resetn] \
  [get_bd_pins axi_smc_1/aresetn] [get_bd_pins axi_smc_2/aresetn] [get_bd_pins dispatcher_0/rst_n] \
  [get_bd_pins regdst_debug_0/rst_n] [get_bd_pins rendertile_packaged_0/rst_n] [get_bd_pins rendertile_packaged_1/rst_n] \
  [get_bd_pins rendertile_packaged_11/rst_n] [get_bd_pins rendertile_packaged_12/rst_n] \
  [get_bd_pins rendertile_packaged_13/rst_n] [get_bd_pins rendertile_packaged_14/rst_n] \
  [get_bd_pins rendertile_packaged_15/rst_n] [get_bd_pins rendertile_packaged_16/rst_n] \
  [get_bd_pins rendertile_packaged_17/rst_n] [get_bd_pins rendertile_packaged_18/rst_n] \
  [get_bd_pins rendertile_packaged_19/rst_n] [get_bd_pins rendertile_packaged_2/rst_n] \
  [get_bd_pins rendertile_packaged_3/rst_n] [get_bd_pins rendertile_packaged_4/rst_n] \
  [get_bd_pins rendertile_packaged_5/rst_n] [get_bd_pins rendertile_packaged_6/rst_n] \
  [get_bd_pins rendertile_packaged_7/rst_n] [get_bd_pins rendertile_packaged_8/rst_n] \
  [get_bd_pins rendertile_packaged_9/rst_n] [get_bd_pins rendertile_packaged_10/rst_n]
connect_bd_net [get_bd_pins sw_breakout_0/SW0] [get_bd_pins ledr_overlay_0/SW0]
connect_bd_net [get_bd_pins sw_breakout_0/SW1] [get_bd_pins ledr_overlay_0/SW1]
connect_bd_net [get_bd_pins zynq_ultra_ps_e_0/pl_clk0] \
  [get_bd_pins zynq_ultra_ps_e_0/maxihpm0_fpd_aclk] [get_bd_pins axi_smc/aclk] [get_bd_pins rst_ps8_0_95M/slowest_sync_clk] \
  [get_bd_pins mmio_dma_0/s00_axi_aclk] [get_bd_pins axi_dma_0/s_axi_lite_aclk] [get_bd_pins axi_dma_0/m_axi_s2mm_aclk] \
  [get_bd_pins zynq_ultra_ps_e_0/saxihpc0_fpd_aclk] [get_bd_pins zynq_ultra_ps_e_0/maxihpm1_fpd_aclk] \
  [get_bd_pins axi_smc_1/aclk] [get_bd_pins axi_smc_2/aclk] [get_bd_pins dispatcher_0/clk] [get_bd_pins regdst_debug_0/clk] \
  [get_bd_pins rendertile_column_sel_0/clk] [get_bd_pins rendertile_packaged_0/clk] [get_bd_pins rendertile_packaged_1/clk] \
  [get_bd_pins rendertile_packaged_11/clk] [get_bd_pins rendertile_packaged_12/clk] [get_bd_pins rendertile_packaged_13/clk] \
  [get_bd_pins rendertile_packaged_14/clk] [get_bd_pins rendertile_packaged_15/clk] [get_bd_pins rendertile_packaged_16/clk] \
  [get_bd_pins rendertile_packaged_17/clk] [get_bd_pins rendertile_packaged_18/clk] [get_bd_pins rendertile_packaged_19/clk] \
  [get_bd_pins rendertile_packaged_2/clk] [get_bd_pins rendertile_packaged_3/clk] [get_bd_pins rendertile_packaged_4/clk] \
  [get_bd_pins rendertile_packaged_5/clk] [get_bd_pins rendertile_packaged_6/clk] [get_bd_pins rendertile_packaged_7/clk] \
  [get_bd_pins rendertile_packaged_8/clk] [get_bd_pins rendertile_packaged_9/clk] [get_bd_pins rendertile_packaged_10/clk] \
  [get_bd_pins bram_stream_controll_0/clk]
connect_bd_net [get_bd_pins zynq_ultra_ps_e_0/pl_resetn0] [get_bd_pins rst_ps8_0_95M/ext_reset_in]

# ---- address map ----
assign_bd_address -offset 0x70000000 -range 256M -target_address_space [get_bd_addr_spaces axi_dma_0/Data_S2MM] [get_bd_addr_segs zynq_ultra_ps_e_0/SAXIGP0/HPC0_DDR_LOW]
exclude_bd_addr_seg -offset 0x00000000 -range 1 -target_address_space [get_bd_addr_spaces axi_dma_0/Data_S2MM] [get_bd_addr_segs zynq_ultra_ps_e_0/SAXIGP0/HPC0_DDR_HIGH]
exclude_bd_addr_seg -offset 0xFF000000 -range 16M -target_address_space [get_bd_addr_spaces axi_dma_0/Data_S2MM] [get_bd_addr_segs zynq_ultra_ps_e_0/SAXIGP0/HPC0_LPS_OCM]
assign_bd_address -offset 0x00A0000000 -range 64K -target_address_space [get_bd_addr_spaces zynq_ultra_ps_e_0/Data] [get_bd_addr_segs mmio_dma_0/S00_AXI/S00_AXI_reg]
assign_bd_address -offset 0x00B0000000 -range 64K -target_address_space [get_bd_addr_spaces zynq_ultra_ps_e_0/Data] [get_bd_addr_segs axi_dma_0/S_AXI_LITE/Reg]

validate_bd_design
save_bd_design
